# EAGLE design pwm-dac-rev2 (EAGLE 6.5.0)

## Sheet 1 of 5: PWM to analog converter
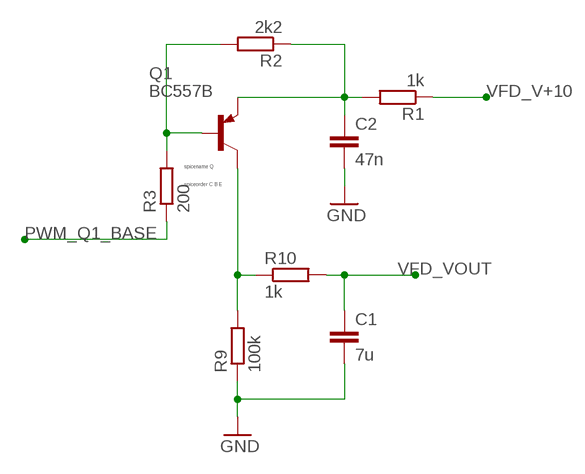
[diagram p0: schematic, sheet 1]

### Parts
C1  7u  C-EU025-025X050  [C025-025X050]
C2  47n  C-EU025-025X050  [C025-025X050]
Q1  BC557B  2N2907  [TO92-EBC-OVAL]
R1  1k  R-EU_0204/7  [0204/7]
R2  2k2  R-EU_0204/7  [0204/7]
R3  200  R-EU_0204/7  [0204/7]
R9  100k  R-EU_0204/7  [0204/7]
R10  1k  R-EU_0204/7  [0204/7]

### Nets
GND: C1.2 C2.2 R9.1 ; also sheet 2,3,4
N$1: C2.1 Q1.E R1.2 R2.1
PWM_Q1_BASE: R3.1 ; also sheet 2
Q3_B: Q1.B R2.2 R3.2
Q3_C: Q1.C R9.2 R10.1
VFD_V+10: R1.1 ; also sheet 4
VFD_VOUT: C1.1 R10.2 ; also sheet 4

## Sheet 2 of 5: Digital signals
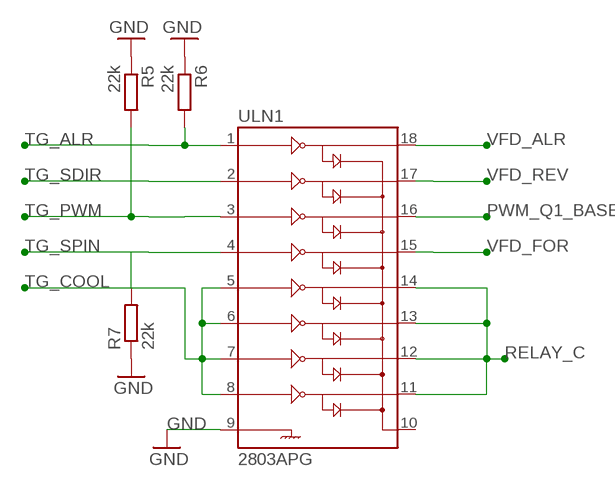
[diagram p1: schematic, sheet 2]

### Parts
R5  22k  R-EU_0204/7  [0204/7]
R6  22k  R-EU_0204/7  [0204/7]
R7  22k  R-EU_0204/7  [0204/7]
ULN1  2803APG  ULN2803DIP  [DIL18]

### Nets
GND: R5.1 R6.1 R7.1 ULN1.9 ; also sheet 1,3,4
PWM_Q1_BASE: ULN1.16 ; also sheet 1
RELAY_C: ULN1.11 ULN1.12 ULN1.13 ULN1.14 ; also sheet 3
TG_ALR: R6.2 ULN1.1 ; also sheet 4
TG_COOL: ULN1.5 ULN1.6 ULN1.7 ULN1.8 ; also sheet 4
TG_PWM: R5.2 ULN1.3 ; also sheet 4
TG_SDIR: ULN1.2 ; also sheet 4
TG_SPIN: R7.2 ULN1.4 ; also sheet 4
VFD_ALR: ULN1.18 ; also sheet 4
VFD_FOR: ULN1.15 ; also sheet 4
VFD_REV: ULN1.17 ; also sheet 4
Unconnected: ULN1.10

## Sheet 3 of 5: Vacuum relay controller
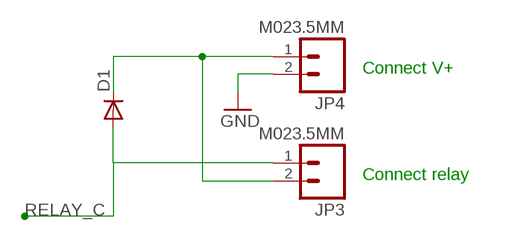
[diagram p2: schematic, sheet 3]

### Parts
D1  DIODE1N4148  [DIODE-1N4148]
JP3  M023.5MM  [SCREWTERMINAL-3.5MM-2]
JP4  M023.5MM  [SCREWTERMINAL-3.5MM-2]

### Nets
GND: JP4.2 ; also sheet 1,2,4
N$2: D1.C JP3.2 JP4.1
RELAY_C: D1.A JP3.1 ; also sheet 2

### Notes on the sheet
- Connect V+
- Connect relay

## Sheet 4 of 5: Connectors
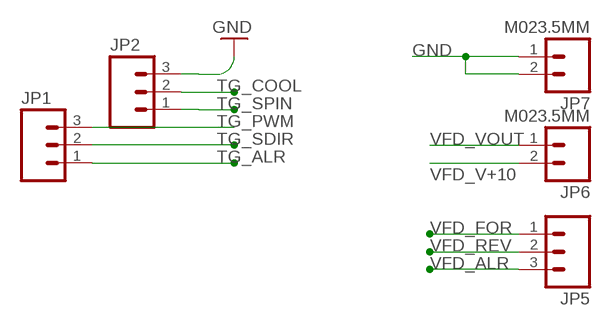
[diagram p3: schematic, sheet 4]

### Parts
JP1  M03SCREW  [SCREWTERMINAL-3.5MM-3]
JP2  M03SCREW  [SCREWTERMINAL-3.5MM-3]
JP5  M03SCREW  [SCREWTERMINAL-3.5MM-3]
JP6  M023.5MM  [SCREWTERMINAL-3.5MM-2]
JP7  M023.5MM  [SCREWTERMINAL-3.5MM-2]

### Nets
GND: JP2.3 JP7.1 JP7.2 ; also sheet 1,2,3
TG_ALR: JP1.1 ; also sheet 2
TG_COOL: JP2.2 ; also sheet 2
TG_PWM: JP1.3 ; also sheet 2
TG_SDIR: JP1.2 ; also sheet 2
TG_SPIN: JP2.1 ; also sheet 2
VFD_ALR: JP5.3 ; also sheet 2
VFD_FOR: JP5.1 ; also sheet 2
VFD_REV: JP5.2 ; also sheet 2
VFD_V+10: JP6.2 ; also sheet 1
VFD_VOUT: JP6.1 ; also sheet 1

## Sheet 5 of 5: Jump wires

## Library data of the parts
C1 C2 = rcl:C-EU: CAPACITOR, European symbol
D1 = SparkFun:DIODE: Diode These are standard reverse protection diodes and small signal diodes. SMA package can handle up to about 1A. SOD-323 can handle about 200mA. What the SOD-323 package when ordering, there are some mfgs out there that are 5-pin packages.
JP1 JP2 JP5 = flux:M03: Header 3 Standard 3-pin 0.1" header. Use with straight break away headers (SKU : PRT-00116), right angle break away headers (PRT-00553), swiss pins (PRT-00743), machine pins (PRT-00117), and female headers (PRT-00115). Molex polarized connector foot print use with SKU : PRT-08232 with associated crimp pins and housings.
JP3 JP4 JP6 JP7 = flux:M02: Standard 2-pin 0.1" header. Use with - straight break away headers ( PRT-00116) - right angle break away headers (PRT-00553) - swiss pins (PRT-00743) - machine pins (PRT-00117) - female headers (PRT-00115) Molex polarized connector foot print use with: PRT-08233 with associated crimp pins and housings. 2.54_SCREWTERM for use with PRT-10571. 3.5mm Screw Terminal footprints for PRT-08084 5mm Screw Terminal footprints for use with PRT-08433
Q1 = flux:2N2907*: PNP Transistor Big Oval pads
R1-R3 R5-R7 R9 R10 = rcl:R-EU_: RESISTOR, European symbol
ULN1 = SparkFun:ULN2803: Darlington Driver ULN2803 Darlington array. 500mA max per channel, 8-channel package. Spark Fun Electronics SKU : COM-00312

## Board
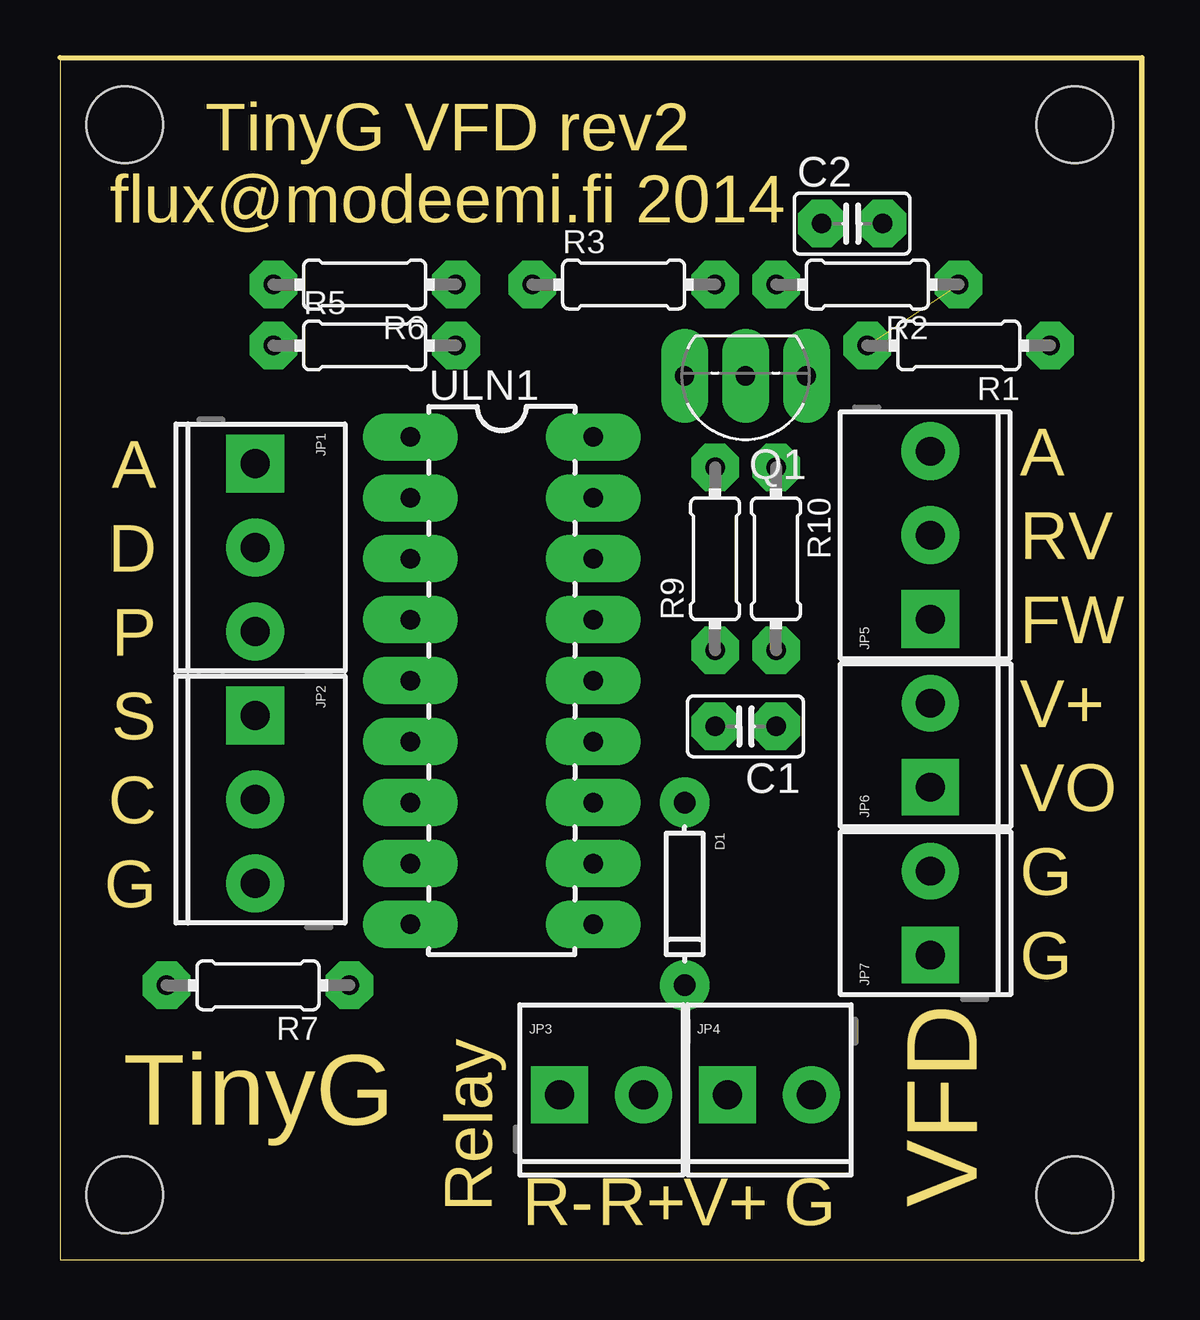
[diagram p4: board, top side]
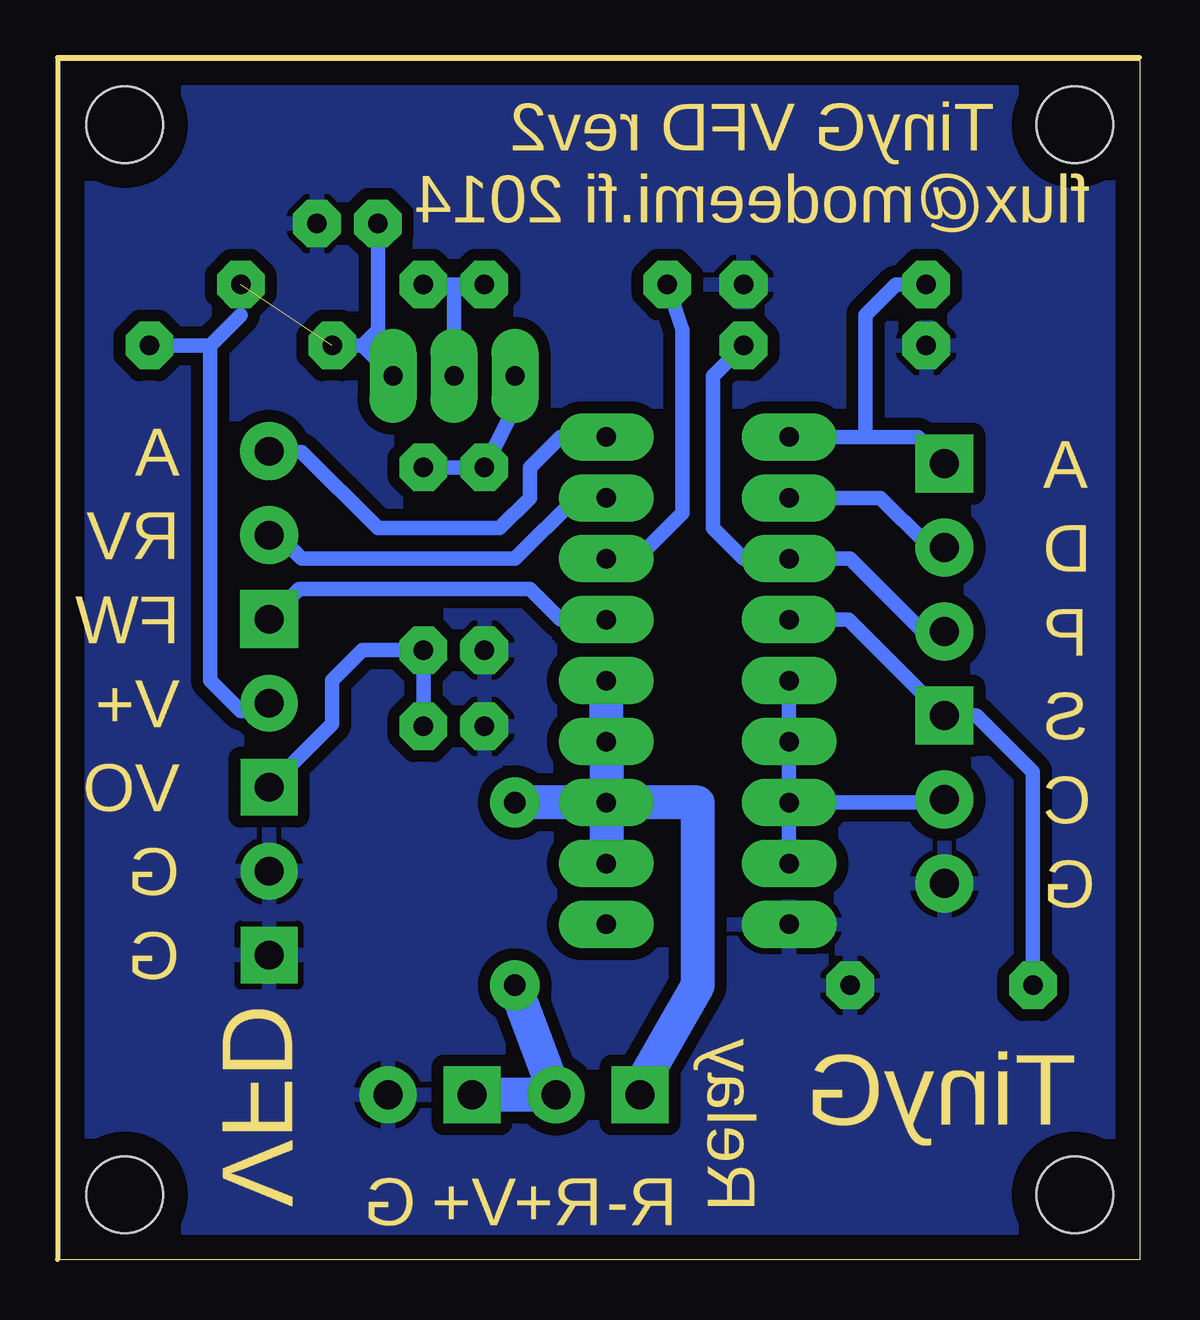
[diagram p5: board, bottom side, seen from below]

Size 45 x 50 mm. Coordinates in mm from the lower left corner, seen from the top.
Outline: 0,0 45,0 45,50 0,50 0,0
Copper layers (1*16): Top 0.035mm / dielectric 1.5mm / Bottom 0.035mm
Design rules "kotipcb *": minimum track width 10mil, minimum drill 24mil, track to track 0.5mm, track to pad 0.4mm, pad to pad 0.4mm, via to via 8mil, smd to smd 8mil, copper to edge 40mil, drill to drill 8mil, minimum pad ring 23mil, minimum via ring 8mil, stop-mask expansion 4mil, vias tented up to drill 0mil, thermal gap 10mil
Holes 3.2 mm at 2.7,47.3 42.3,47.3 42.3,2.7 2.7,2.7
Milling: 2 lines

### Footprints (pad centres in the part's own frame; a part is rotated, then mirrored left to right if it is on the bottom)
C025-025X050 = drill 0.813 octagon: 1 -1.27,0; 2 1.27,0
DIODE-1N4148 = drill 0.9 pad 1.88: A -3.81,0; C 3.81,0
SCREWTERMINAL-3.5MM-3 = drill 1.2 pad 2.413 square: 1 0,0 | drill 1.2 pad 2.413: 2 3.5,0; 3 7,0
SCREWTERMINAL-3.5MM-2 = drill 1.2 pad 2.032 square: 1 0,0 | drill 1.2 pad 2.032: 2 3.5,0
TO92-EBC-OVAL = drill 0.8 long: B 0,-1.27; C 2.54,-1.27; E -2.54,-1.27
0204/7 = drill 0.813 octagon: 1 -3.81,0; 2 3.81,0
DIL18 = drill 0.813 long: 1 -10.16,-3.81; 2 -7.62,-3.81; 3 -5.08,-3.81; 4 -2.54,-3.81; 5 0,-3.81; 6 2.54,-3.81; 7 5.08,-3.81; 8 7.62,-3.81; 9 10.16,-3.81; 10 10.16,3.81; 11 7.62,3.81; 12 5.08,3.81; 13 2.54,3.81; 14 0,3.81; 15 -2.54,3.81; 16 -5.08,3.81; 17 -7.62,3.81; 18 -10.16,3.81

### Placement (x,y rotation side)
C1  28.57,22.23 180 top
C2  33.02,43.18 0 top
D1  26.04,15.24 270 top
JP1  8.13,33.17 270 top
JP2  8.13,22.68 270 top
JP3  20.82,6.87 0 top
JP4  27.82,6.87 0 top
JP5  36.28,26.69 90 top
JP6  36.28,19.69 90 top
JP7  36.28,12.69 90 top
Q1  28.57,35.56 180 top
R1  37.47,38.1 180 top
R2  33.66,40.64 180 top
R3  23.5,40.64 0 top
R5  12.7,38.1 0 top
R6  12.7,40.64 180 top
R7  8.26,11.43 180 top
R9  27.3,29.21 90 top
R10  29.84,29.21 270 top
ULN1  18.41,24.13 270 top

### Tracks (layer width: path | path; a pad name or v marks a point on that pad's centre or on a via)
GND
  pour Bottom: 0,50 0,0 45,0 45,50
N$1  (1 unrouted)
  Bottom 0.6: Q1.E 32.38,38.1 | 32.38,38.1 R1.2 | 32.38,38.1 31.75,38.73 C2.1
N$2
  Bottom 1.422: JP4.1 JP3.2 D1.C
PWM_Q1_BASE
  Bottom 0.6: ULN1.16 20.95,29.21 19.05,31.11 19.05,36.83 19.05,38.73 R3.1
Q3_B
  Bottom 0.6: R3.2 28.57,40.64 | 28.57,40.64 R2.2 | Q1.B 28.57,40.64
Q3_C
  Bottom 0.6: R10.1 R9.2 26.04,35.56 Q1.C
RELAY_C
  Bottom 0.6: JP3.1 20.95,7
  Bottom 1.422: 20.95,7 18.41,11.43 18.41,15.24 18.41,19.05 | ULN1.12 ULN1.13 ULN1.14 | ULN1.12 ULN1.11 | 18.41,19.05 D1.A | 18.41,19.05 ULN1.12
TG_ALR
  Bottom 0.6: 9.25,34.29 JP1.1 9.25,34.29 | 9.25,34.29 9.53,34.29 | 9.53,34.29 11.43,34.29 | 11.43,34.29 ULN1.1 | 9.25,34.29 9.53,34.29 | 9.53,34.29 11.43,34.29 | 11.43,34.29 11.43,39.37 10.16,40.64 R6.2
TG_COOL
  Bottom 0.6: JP2.2 8.26,19.05 ULN1.7 | ULN1.7 ULN1.6 ULN1.5 | ULN1.7 ULN1.8
TG_PWM
  Bottom 0.6: R5.2 17.78,36.83 17.78,30.48 16.51,29.21 ULN1.3 12.06,29.21 8.89,26.04 8.28,26.04 JP1.3
TG_SDIR
  Bottom 0.6: JP1.2 8.3,29.84 8.89,29.84 10.79,31.75 ULN1.2
TG_SPIN
  Bottom 0.6: R7.2 4.45,20.32 6.8,22.68 JP2.1 12.13,26.67 ULN1.4
VFD_ALR
  Bottom 0.6: JP5.3 36.25,33.66 34.92,33.66 31.75,30.48 26.67,30.48 25.4,31.75 25.4,33.02 24.13,34.29 22.86,34.29 ULN1.18
VFD_FOR
  Bottom 0.6: JP5.1 35.03,27.94 31.75,27.94 25.4,27.94 24.13,26.67 ULN1.15
VFD_REV
  Bottom 0.6: JP5.2 35.94,29.84 35.56,29.84 34.92,29.21 26.04,29.21 23.5,31.75 ULN1.17
VFD_V+10
  Bottom 0.6: JP6.2 36.62,22.86 37.47,22.86 38.73,24.13 38.73,36.83 | 38.73,36.83 38.73,38.1 | 38.73,38.1 37.47,39.37 38.73,38.1 | 38.73,38.1 38.73,36.83 | 38.73,38.1 R1.1
VFD_VOUT
  Bottom 0.6: C1.1 R10.2 32.38,25.4 33.66,24.13 33.66,22.32 JP6.1

### Text on the board
Milling: TinyG VFD rev2 / flux@modeemi.fi 2014 | A | A | D | RV | FW | P | S | V+ | VO | C | G | G | G | VFD | TinyG | R- | R+ | V+ | G | Relay